# Altium schematic sheet main.SchDoc
size A4
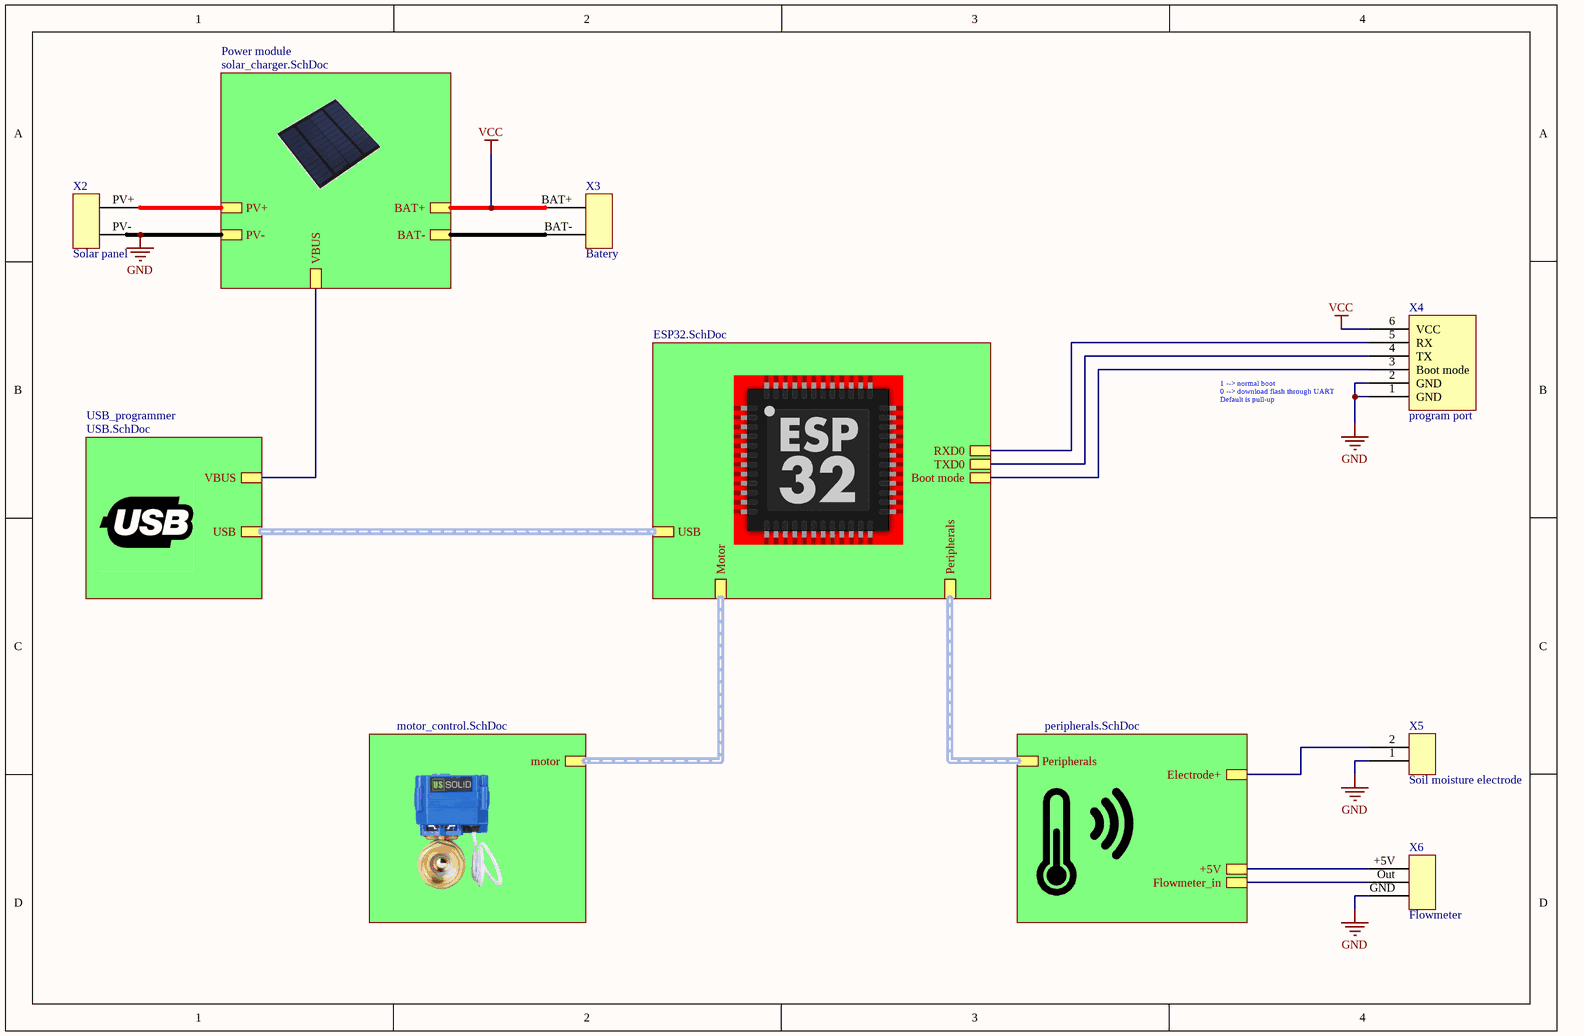
[diagram p0: main.SchDoc]

## Parts
X2  Solar panel  [Solar Panel connenctor]
X3  Batery  [Battery connector]
X4  program port  [A2543WV-6P]
X5  Soil moisture electrode  [Soil moisture sensor - long]
X6  Flowmeter  [Flowmeter]

## Sub-sheets
Designator = ESP32.SchDoc: Motor, RXD0, TXD0, Boot mode, Peripherals, USB
Designator = motor_control.SchDoc: motor
Designator = peripherals.SchDoc: Peripherals, Electrode+, +5V, Flowmeter_in
Power module = solar_charger.SchDoc: PV-, BAT+, BAT-, VBUS, PV+
USB_programmer = USB.SchDoc: USB, VBUS

## Nets
GND: X2.PV- X4.1(GND) X4.2(GND) X5.1 X6.GND ; sheet Power module/PV-
VCC: X3.BAT+ X4.6(VCC) ; sheet Power module/BAT+
NetX2_PV+: X2.PV+ ; sheet Power module/PV+
NetX3_BAT-: X3.BAT- ; sheet Power module/BAT-
NetX4_3: X4.3(Boot_mode) ; sheet Designator/Boot mode
NetX4_4: X4.4(TX) ; sheet Designator/TXD0
NetX4_5: X4.5(RX) ; sheet Designator/RXD0
NetX5_2: X5.2 ; sheet Designator/Electrode+
NetX6_+5V: X6.+5V ; sheet Designator/+5V
NetX6_Out: X6.Out ; sheet Designator/Flowmeter_in
(unnamed): sheet Power module/VBUS, sheet USB_programmer/VBUS

## Buses and harness runs
harness sheet Designator/Motor = sheet Designator/motor
harness sheet Designator/USB = sheet USB_programmer/USB

## Notes on the sheet
- 1 --> normal boot
  0 --> download flash through UART
  Default is pull-up

## Library data of the parts
X4 = program port - 6 pin: LCSC Part #: C239366
X5 = Soil moisture sensor